# EAGLE schematic TCD (EAGLE 9.7.0)
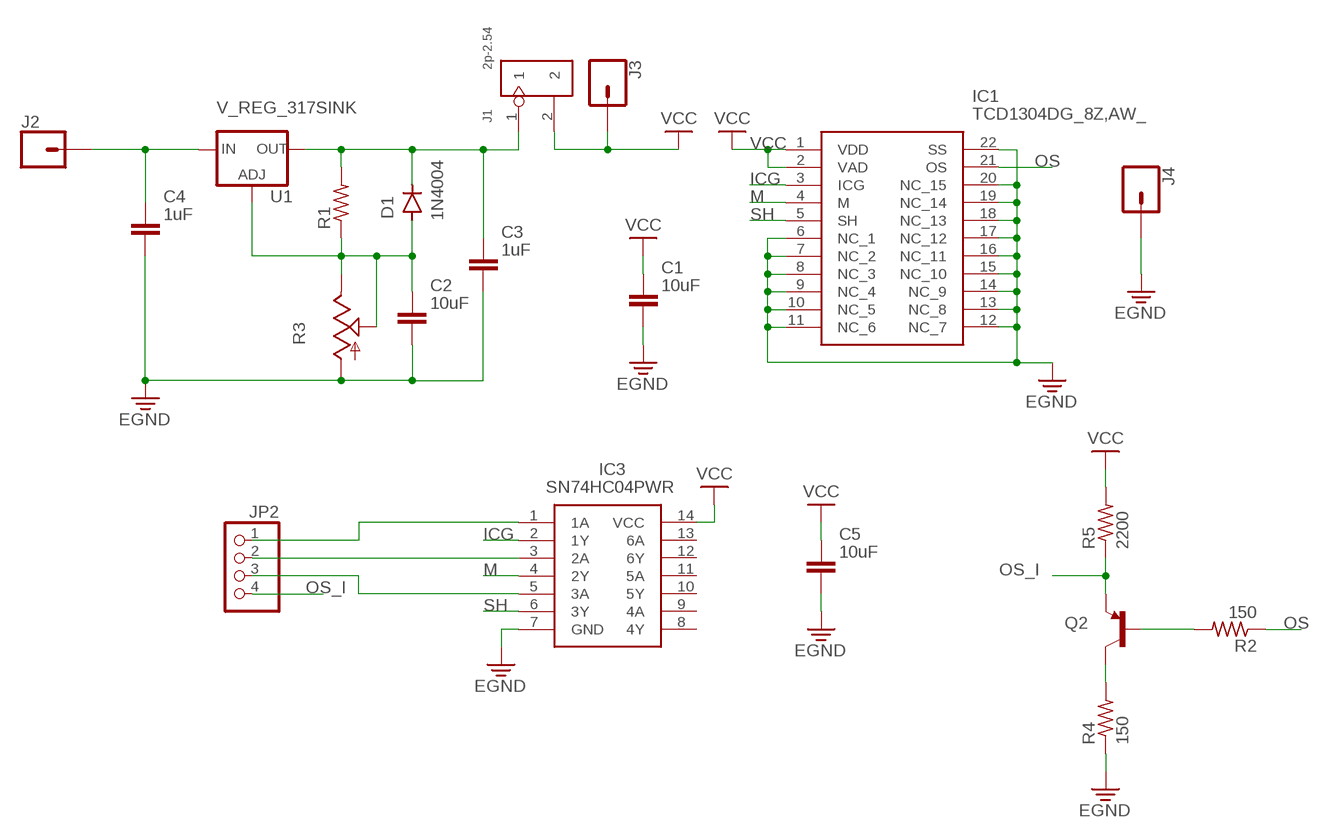
[diagram p0: schematic, sheet 1]

## Parts
C1  10uF  C_CHIP-0603(1608-METRIC)  [CAPC1608X85]
C2  10uF  C_CHIP-0603(1608-METRIC)  [CAPC1608X85]
C3  1uF  C_CHIP-0603(1608-METRIC)  [CAPC1608X85]
C4  1uF  C_CHIP-0603(1608-METRIC)  [CAPC1608X85]
C5  10uF  C_CHIP-0603(1608-METRIC)  [CAPC1608X85]
D1  1N4004  [DO-41]
IC1  TCD1304DG_8Z,AW_  [DIP1016W62P254L4160H372Q22N]
IC3  SN74HC04PWR  [SOP65P640X120-14N]
J1  2p-2.54  DIP-BLACK-MALE-HEADER-VERT(2P-2.54)  [H2-2.54]
J2  CONN_01  [1X01]
J3  CONN_01  [1X01]
J4  CONN_01  [1X01]
JP2  PINHD-1X4  [1X04]
Q2  TRANSISTOR_PNPBC558  [TO-92-AMMO]
R1  R-US_R0603  [R0603]
R2  150  R-US_R0603  [R0603]
R3  TRIM_US-RJ9W  [RJ9W]
R4  150  R-US_R0603  [R0603]
R5  2200  R-US_R0603  [R0603]
U1  V_REG_317SINK  [TO220-ADJ]

## Nets
EGND: C1.2 C2.2 C3.2 C4.2 C5.2 IC1.6(NC_1) IC1.7(NC_2) IC1.8(NC_3) IC1.9(NC_4) IC1.10(NC_5) IC1.11(NC_6) IC1.12(NC_7) IC1.13(NC_8) IC1.14(NC_9) IC1.15(NC_10) IC1.16(NC_11) IC1.17(NC_12) IC1.18(NC_13) IC1.19(NC_14) IC1.20(NC_15) IC1.22(SS) IC3.7(GND) J4.1 R3.A R4.1
ICG: IC1.3(ICG) IC3.2(1Y)
M: IC1.4(M) IC3.4(2Y)
N$1: C3.1 D1.C J1.1 R1.2 U1.OUT
N$2: C2.1 D1.A R1.1 R3.E R3.S U1.ADJ
N$3: C4.1 J2.1 U1.IN
N$5: Q2.2(B) R2.2
N$6: IC3.1(1A) JP2.1
N$8: IC3.3(2A) JP2.2
N$9: Q2.1(C) R4.2
N$10: IC3.5(3A) JP2.3
OS: IC1.21(OS) R2.1
OS_I: JP2.4 Q2.3(E) R5.1
SH: IC1.5(SH) IC3.6(3Y)
VCC: C1.1 C5.1 IC1.1(VDD) IC1.2(VAD) IC3.14(VCC) J1.2 J3.1 R5.2
Unconnected: IC3.8(4Y) IC3.9(4A) IC3.10(5Y) IC3.11(5A) IC3.12(6Y) IC3.13(6A)

## Library data of the parts
C1-C5 = Capacitor:C: Capacitor - Generic; CATEGORY: Capacitor
D1 = Diodes:1N4004: DIODE GEN PURP 400V 1A DO41 Manufacturer's datasheet <https://www.mccsemi.com/pdf/Products/1N4001-1N4007(DO-41).pdf>; CREATED_BY: PCBLayout.com; DIGIKEY_PART_NUMBER: 1N4004MSCT-ND; MANUFACTURER: Micro Commercial Co; MPN: 1N4004; PACKAGE: DO-41
IC1 = SamacSys_Parts:TCD1304DG_8Z,AW_: Image Sensors & Color Sensors CCD Linear Sensor 3648 8x20 54mm Source: Datasheet <http://www.spectralproducts.com/pdf/TCD1304.pdf>; DESCRIPTION: Image Sensors & Color Sensors CCD Linear Sensor 3648 8x20 54mm; HEIGHT: 3.72mm; MANUFACTURER_NAME: Toshiba; MANUFACTURER_PART_NUMBER: TCD1304DG(8Z,AW); MOUSER_PART_NUMBER: 757-TCD1304DG8ZAW; MOUSER_PRICE-STOCK: https://www.mouser.co.uk/ProductDetail/Toshiba/TCD1304DG8ZAW?qs=OLJpxlzHOSRVMcyirxbASw%3D%3D
IC3 = SamacSys_Parts:SN74HC04PWR: Hex Inverters Source: Datasheet <http://www.ti.com/lit/gpn/sn74hc04>; DESCRIPTION: Hex Inverters; HEIGHT: 1.2mm; MANUFACTURER_NAME: Texas Instruments; MANUFACTURER_PART_NUMBER: SN74HC04PWR; MOUSER_PART_NUMBER: 595-SN74HC04PWR; MOUSER_PRICE-STOCK: https://www.mouser.co.uk/ProductDetail/Texas-Instruments/SN74HC04PWR?qs=%252BWCn1GN4mVxU6wq6t1LIyQ%3D%3D
J1 = OPL_Connector:DIP-BLACK-MALE-HEADER-VERT(2P-2.54): 320020016; MPN: P125-1102A0BS116A1
J2-J4 = SparkFun-Connectors:CONN_01: Single connection point. Often used as Generic Header-pin footprint for 0.1 inch spaced/style header connections On any of the 0.1 inch spaced packages, you can populate with these: Break Away Headers - Straight <https://www.sparkfun.com/products/116> (PRT-00116) Break Away Male Headers - Right Angle <https://www.sparkfun.com/products/553> (PRT-00553) Female Headers <https://www.sparkfun.com/products/115> (PRT-00115) Break Away Headers - Machine Pin <https://www.sparkfun.com/products/117> (PRT-00117) Break Away Female Headers - Swiss Machine Pin <https://www.sparkfun.com/products/743> (PRT-00743) This device is also useful as a general connection point to wire up your design to another part of your project. Our various solder wires solder well into these plated through hole pads. Hook-Up Wire - Assortment (Stranded, 22 AWG) <https://www.sparkfun.com/products/11375> (PRT-11375) Hook-Up Wire - Assortment (Solid Core, 22 AWG) <https://www.sparkfun.com/products/11367> (PRT-11367) View the entire wire category on our website here <https://www.sparkfun.com/categories/141> Special notes: SMTSO-256-ET is a "flush mount" nut for a 4-40 screw. We mostly use this on specialty testbeds; it is a nice way to connect hardware to your PCB at an adjustable hieght. Also note, the SNAP packages are for using a snappable style connector. We sell a baggie of snaps and they are also used on two LilyPad designs: Snap Assortment - 30 pack (male and female) <https://www.sparkfun.com/products/11347> (DEV-11347) LilyPad Arduino SimpleSnap <https://www.sparkfun.com/products/10941> (DEV-10941) LilyPad SimpleSnap Protoboard <https://www.sparkfun.com/products/10940> (DEV-10940)
JP2 = pinhead:PINHD-1X4: PIN HEADER
Q2 = User-Submitted:TRANSISTOR_PNP: Generic PNP BJT Double check pinouts against datasheets- not all devices are the same! MMBT3906 - 40V 200mA SOT-23 (TRANS-08052) MMBT4403 - 40V 600mA SOT-23 (TRANS-09245)
R1 R2 R4 R5 = rcl:R-US_: RESISTOR, American symbol; SPICEPREFIX: R
R3 = pot:TRIM_US-: POTENTIOMETER
U1 = SparkFun-IC-Power:V_REG_317: Voltage Regulator Standard LM317 adjustable voltage regulator. AOI (Adjust Output Input). Google 'LM317 Calculator' for easy to use app to get the two resistor values needed. 240/720 for 5V output. 240/390 for 3.3V output. Spark Fun Electronics SKU : COM-00527